# EAGLE design zxld381-boost-driver-12mm-mk-1 (EAGLE 6.5.0)
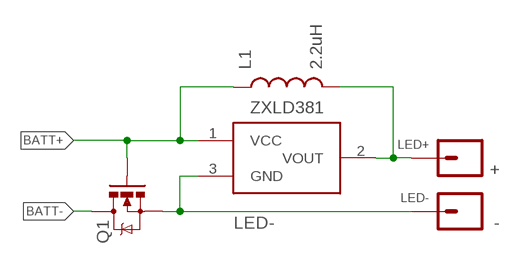
[diagram p0: schematic, sheet 1]

## Parts
+  M01PTH-NS-NOTSUCK  [1X01NSATALL]
-  M01PTH-NS-NOTSUCK  [1X01NSATALL]
L1  2.2uH  INDUCTOR0805  [0805]
Q1  MOSFET-NCHANNELIRLML2502  [SOT23]
ZXLD381  ZXLD381  [SOT23-3]

## Nets
BATT+: L1.1 Q1.1(G) ZXLD381.1(VCC)
BATT-: Q1.3(D)
LED+: +.1 L1.2 ZXLD381.2(VOUT)
LED-: -.1 Q1.2(S) ZXLD381.3(GND)

## Library data of the parts
+ - = A_butts:M01: Header 1 Standard 1-pin 0.1" header. Use with straight break away headers (SKU : PRT-00116), right angle break away headers (PRT-00553), swiss pins (PRT-00743), machine pins (PRT-00117), and female headers (PRT-00115).
L1 = A_butts:INDUCTOR: Inductors Basic Inductor/Choke - 0603 and 1206. Footprints are not proven and vary greatly between part numbers. SRN6045- 33uH, 20% 1.4A SDR0403-560KL - 56uH, 10%, 500mA RMS/740mA peak
Q1 = A_butts:MOSFET-NCHANNEL: Common NMOSFET Parts MFG P/N Store ID Prod ID FDD8780 TRANS-09984 SI7820DN TRANS-11055 FDS6630A IC-08089 2N7002PW TRANS-11151 FQP30N06L COM-10213 TRANS-10060 BSS123LT1G TRANS-08345 BSS138 TRANS-00830 BS170 2N7000
ZXLD381 = A_butts:ZXLD381

## Board
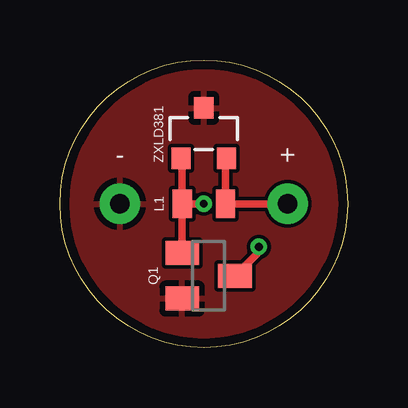
[diagram p1: board, top side]
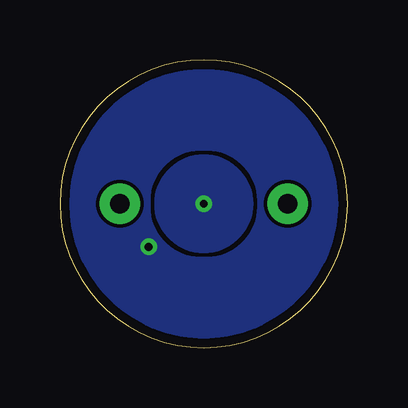
[diagram p2: board, bottom side, seen from below]

Size 12 x 12 mm. Coordinates in mm from the lower left corner, seen from the top.
Outline: 6,0 arc-90 0,6 arc-90 6,12 arc-90 12,6 arc-90 6,0
Copper layers (1*16): Top 0.0356mm / dielectric 1.5011mm / Bottom 0.0356mm
Design rules "LaenPCBOrder2": minimum track width 6mil, minimum drill 13mil, track to track 6mil, track to pad 6mil, pad to pad 6mil, via to via 6mil, smd to smd 6mil, copper to edge 15mil, drill to drill 6mil, minimum pad ring 7mil, minimum via ring 7mil, stop-mask expansion 3mil, vias tented up to drill 20mil, thermal gap 10mil

### Footprints (pad centres in the part's own frame; a part is rotated, then mirrored left to right if it is on the bottom)
1X01NSATALL = drill 0.8 pad 1.676: 1 0,0
0805 = smd 0.8 x 1.2: 1 -0.9,0; 2 0.9,0
SOT23 = smd 1 x 1.4: 1 -0.95,-1.1; 2 0.95,-1.1; 3 0,1.1
SOT23-3 = smd 0.8 x 0.9: 1 -0.95,-1; 2 0.95,-1; 3 0,1.1

### Placement (x,y rotation side)
+  9.5,6 0 top
-  2.5,6 0 top
L1  6,6 0 top
Q1  6.2,3 270 top
ZXLD381  6,8.9 0 top

### Tracks (layer width: path | path; a pad name or v marks a point on that pad's centre or on a via)
BATT+  (via drill 0.33)
  Top 0.305: ZXLD381.1 5.1,7.85 L1.1 | L1.1 v6,6 | L1.1 Q1.1
  pour Bottom: 6,8 arc90 4,6 arc90 6,4 arc90 8,6 arc90
BATT-  (via drill 0.33)
  Top 0.305: Q1.3 8.3,4 v8.3,4.2
  pour Bottom (rank 6): 6,0 arc-90 0,6 arc-90 6,12 arc-90 12,6 arc-90
LED+
  Top 0.305: ZXLD381.2 6.9,7.85 L1.2 +.1
LED-
  pour Top (rank 6): 6,0 arc-90 0,6 arc-90 6,12 arc-90 12,6 arc-90